# EAGLE design Painel_V1.0.2 (EAGLE 8.2.2)
CNAME: SimulaCare; CREVISION: 1.0.2; DESIGNER: Rinaldo
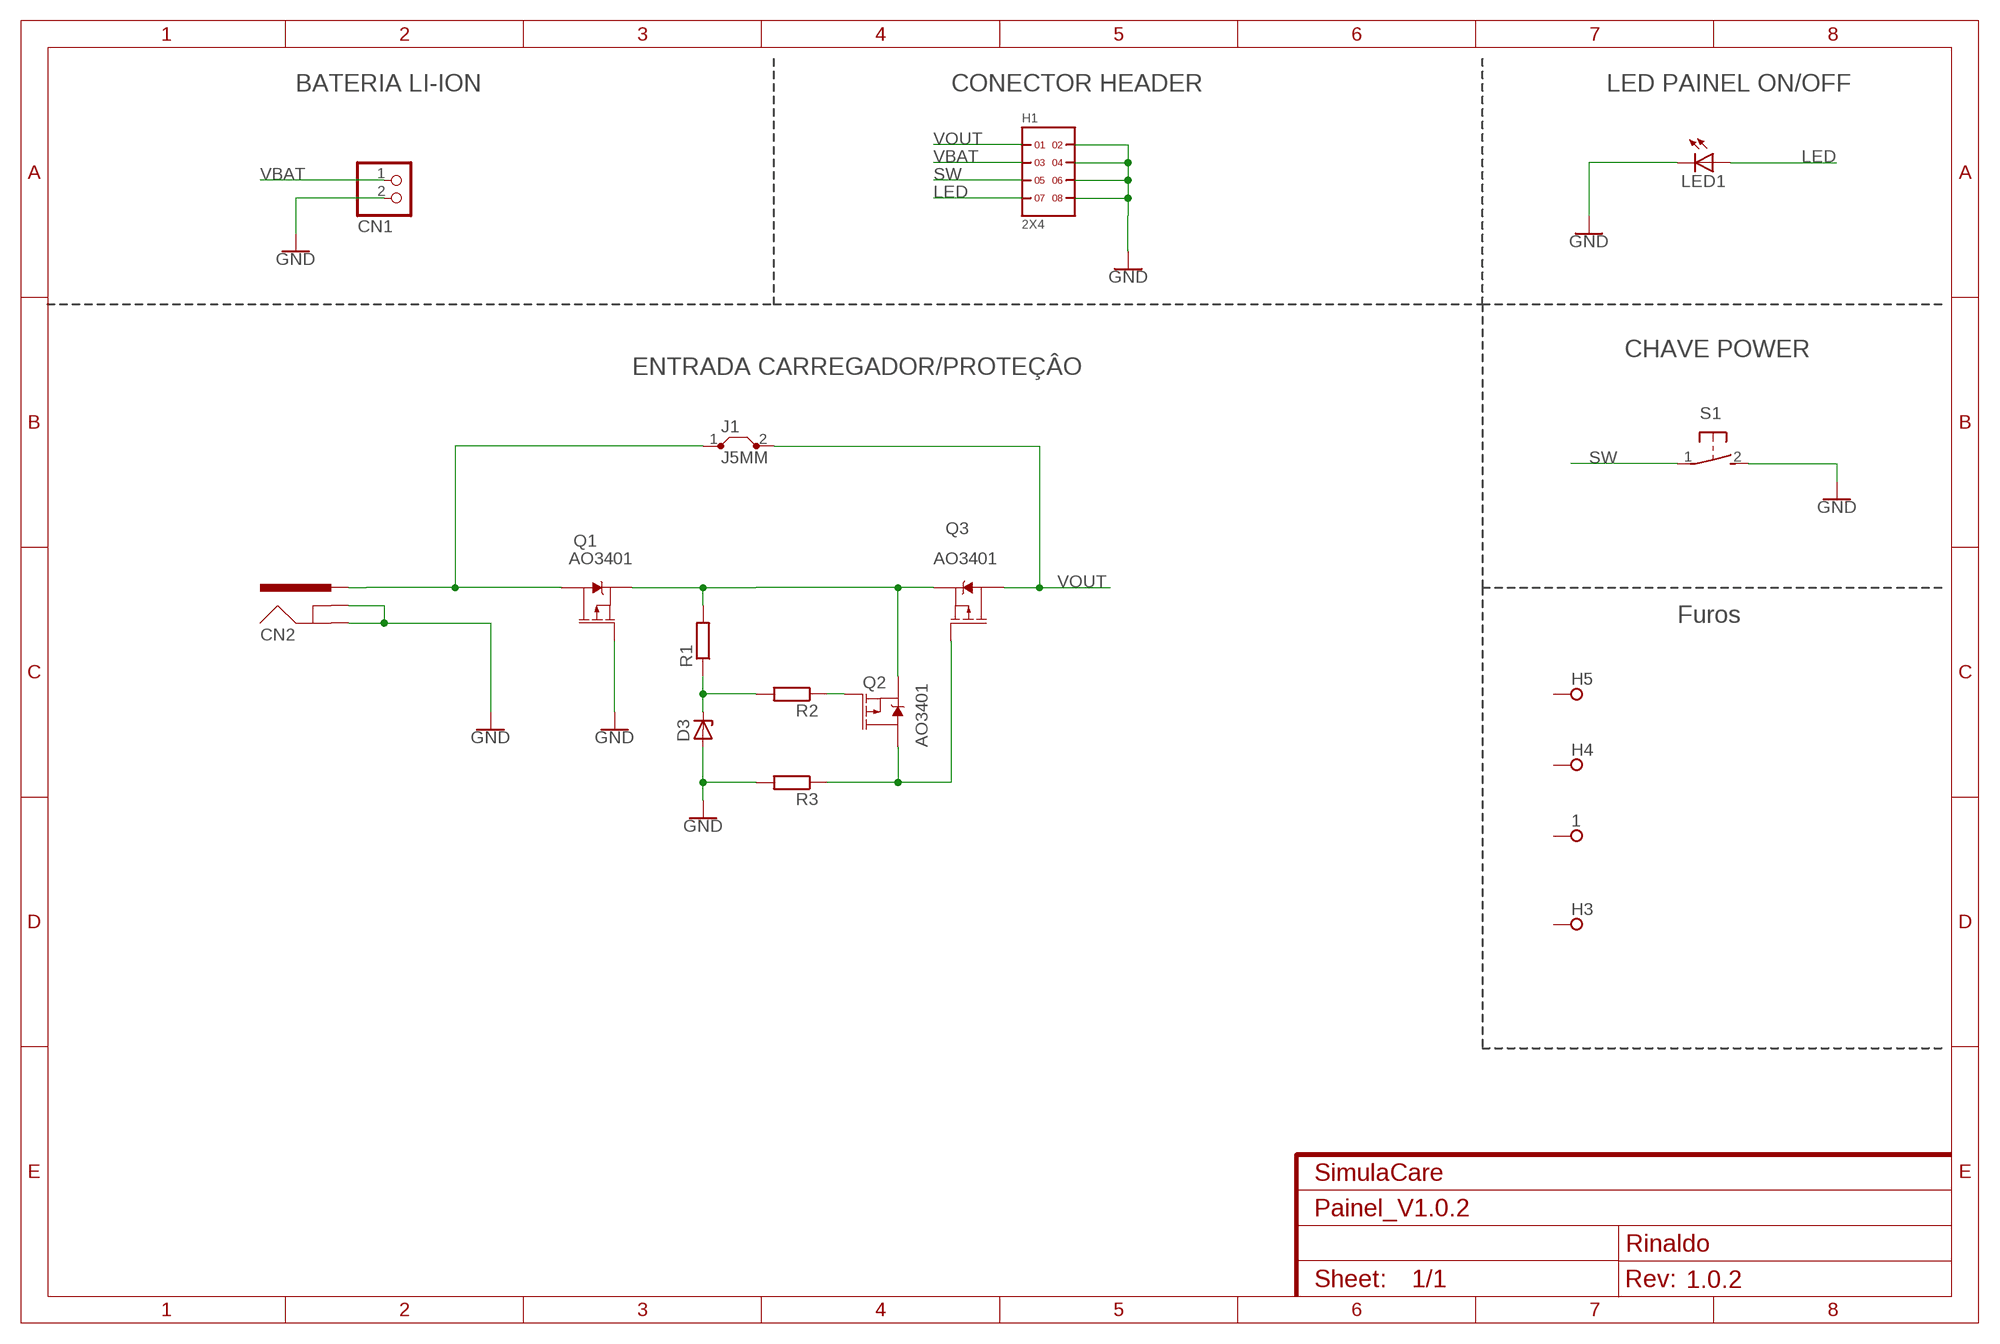
[diagram p0: schematic, sheet 1]

## Parts
1  SPECIAL_DRILL_0.1250  [PAD_0.1250]
CN1  JST_2PIN-THM  [JST-PH-2-THM]
CN2  POWERJACK  [POWERJACK]
D3  ZENER-DIODESOT23  [SOT23]
H1  2X4  [2X4]
H3  SPECIAL_DRILL_0.1250  [PAD_0.1250]
H4  SPECIAL_DRILL_0.1250  [PAD_0.1250]
H5  SPECIAL_DRILL_0.1250  [PAD_0.1250]
J1  J5MM  [05]
LED1  LED3MM  [LED3MM]
Q1  AO3401  MOSFET_PCH-IRLML2244  [SOT23-3]
Q2  AO3401  MOSFET_PCH-IRLML2244  [SOT23-3]
Q3  AO3401  MOSFET_PCH-IRLML2244  [SOT23-3]
R1  R-EU_R0603  [R0603]
R2  R-EU_R0603  [R0603]
R3  R-EU_R0603  [R0603]
S1  31-XX  [B3F-31XX]

## Nets
GND: CN1.2 CN2.GND CN2.GNDBREAK D3.1(A) H1.2 H1.4 H1.6 H1.8 LED1.K(C) Q1.1(G) R3.2 S1.2(S)
LED: H1.7 LED1.A
N$1: Q1.2(S) Q2.2(S) Q3.2(S) R1.2
N$2: D3.3(C) R1.1 R2.2
N$3: Q2.1(G) R2.1
N$4: Q2.3(D) Q3.1(G) R3.1
SW: H1.5 S1.1(P)
VBAT: CN1.1 H1.3
VCC: CN2.PWR J1.1 Q1.3(D)
VOUT: H1.1 J1.2 Q3.3(D)
Unconnected: 1.1 H3.1 H4.1 H5.1

## Notes on the sheet
- BATERIA LI-ION | CONECTOR HEADER | LED PAINEL ON/OFF
- CHAVE POWER
- ENTRADA CARREGADOR/PROTEÇÂO
- Furos

## Library data of the parts
1 H3-H5 = special-drill:SPECIAL_DRILL_: Special drills
CN1 = adafruit:JST_2PIN: JST 2-Pin Connectors of various flavors SMT-RA (S2B-PH-SM4) 4UConnector #17311 SMT (B2B-PH-SM4) THM-RA (S2B-PH) THM (B2B-PH)
CN2 = mbr0520:POWERJACK: Power Jack Standard 2.1 mm * 5.5 mm barrel jack for power (e.g. Arduino).
D3 = diode:ZENER-DIODE: Z-Diode
H1 = headers(.1in):2X4
J1 = jumper:J: Bridge
LED1 = adafruit:LED: LED OSRAM: - CHIPLED LG R971, LG N971, LY N971, LG Q971, LY Q971, LO R971, LY R971 LH N974, LH R974 LS Q976, LO Q976, LY Q976 LO Q996 - Hyper CHIPLED LW Q18S LB Q993, LB Q99A, LB R99A - SideLED LS A670, LO A670, LY A670, LG A670, LP A670 LB A673, LV A673, LT A673, LW A673 LH A674 LY A675 LS A676, LA A676, LO A676, LY A676, LW A676 LS A679, LY A679, LG A679 - Hyper Micro SIDELED® LS Y876, LA Y876, LO Y876, LY Y876 LT Y87S - SmartLED LW L88C, LW L88S LB L89C, LB L89S, LG L890 LS L89K, LO L89K, LY L89K LS L896, LA L896, LO L896, LY L896 - TOPLED LS T670, LO T670, LY T670, LG T670, LP T670 LSG T670, LSP T670, LSY T670, LOP T670, LYG T670 LG T671, LOG T671, LSG T671 LB T673, LV T673, LT T673, LW T673 LH T674 LS T676, LA T676, LO T676, LY T676, LB T676, LH T676, LSB T676, LW T676 LB T67C, LV T67C, LT T67C, LS T67K, LO T67K, LY T67K, LW E67C LS E67B, LA E67B, LO E67B, LY E67B, LB E67C, LV E67C, LT E67C LW T67C LS T679, LY T679, LG T679 LS T770, LO T770, LY T770, LG T770, LP T770 LB T773, LV T773, LT T773, LW T773 LH T774 LS E675, LA E675, LY E675, LS T675 LS T776, LA T776, LO T776, LY T776, LB T776 LHGB T686 LT T68C, LB T68C - Hyper Mini TOPLED® LB M676 - Mini TOPLED Santana® LG M470 LS M47K, LO M47K, LY M47K Source: http://www.osram.convergy.de/
Q1-Q3 = SparkFun-DiscreteSemi:MOSFET_PCH: P-channel MOSFETs Voltage controlled devices that allow control of high current outputs. SparkFun Products: SparkFun ESP32 Thing <https://www.sparkfun.com/products/13907> SparkFun ESP8266 Thing <https://www.sparkfun.com/products/13231>; PROD_ID: TRANS-11153; VALUE: 4.3A/20V/54mΩ
R1-R3 = resistor:R-EU_: RESISTOR, European symbol
S1 = adafruit:31-XX: OMRON SWITCH Now with beefier pads!

## Board
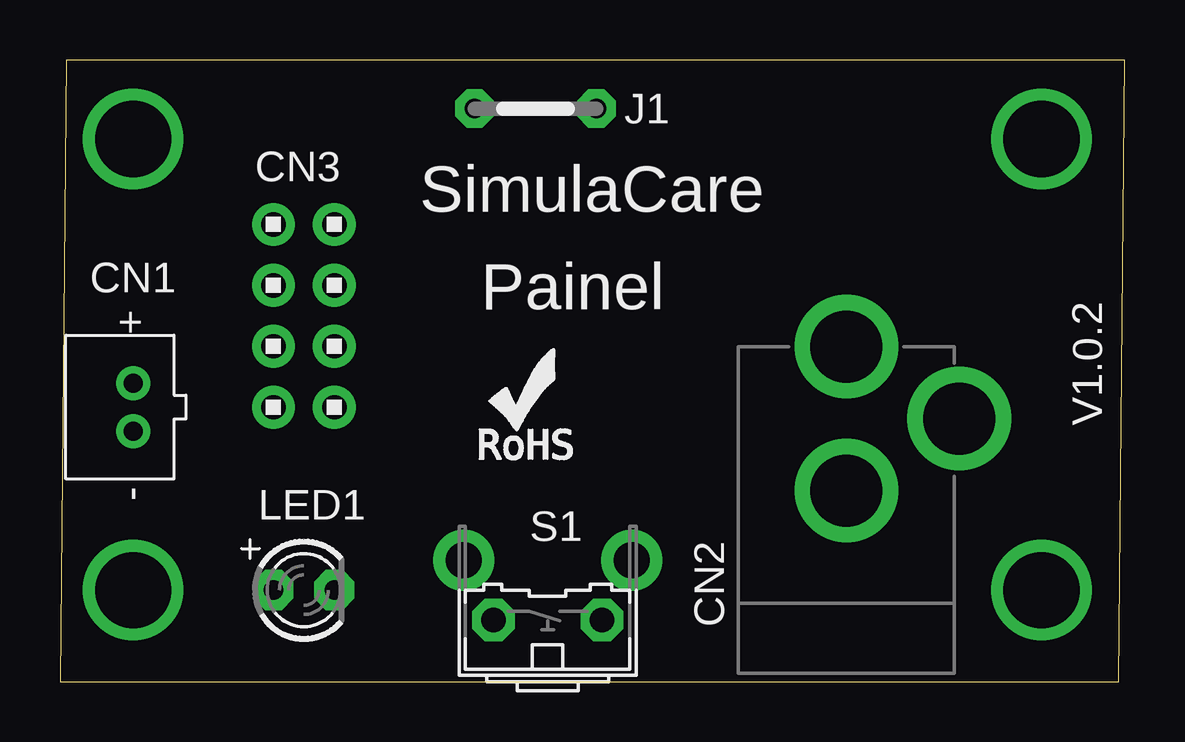
[diagram p1: board, top side]
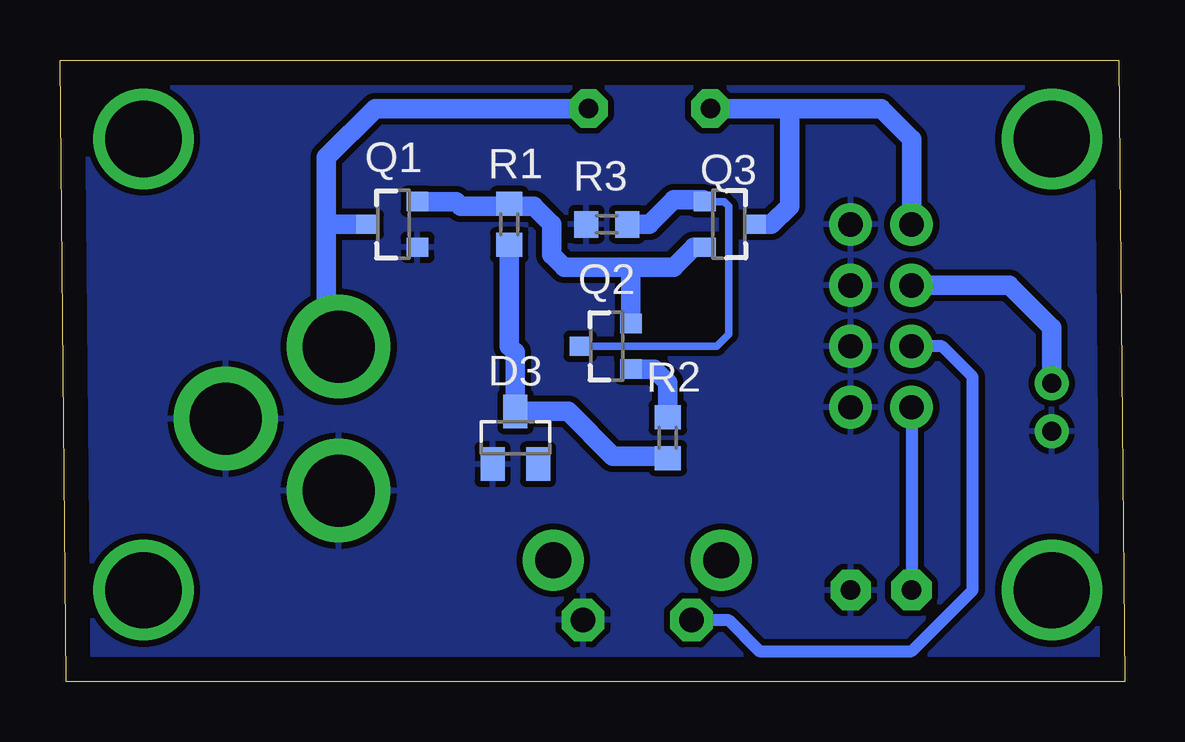
[diagram p2: board, bottom side, seen from below]

Size 44.37 x 25.9 mm. Coordinates in mm from the lower left corner, seen from the top.
Outline: 0,0 44.12,0 44.37,25.9 0.25,25.9 0,0
Copper layers (1*16): Top 0.035mm / dielectric 1.5mm / Bottom 0.035mm
Design rules "default *": minimum track width 8mil, minimum drill 0.5mm, track to track 10mil, track to pad 10mil, pad to pad 10mil, via to via 10mil, smd to smd 10mil, copper to edge 40mil, drill to drill 8mil, minimum pad ring 10mil, minimum via ring 8mil, stop-mask expansion 4mil, vias tented up to drill 0mil, thermal gap 10mil

### Footprints (pad centres in the part's own frame; a part is rotated, then mirrored left to right if it is on the bottom)
PAD_0.1250 = drill 3.175 pad 3.175: 1 0,0
JST-PH-2-THM = drill 0.8 pad 1.422: 1 1,0; 2 -1,0
POWERJACK = drill 2.997 pad 4.318: GND 0,7.7; GNDBREAK 4.7,10.7; PWR 0,13.7
SOT23 = smd 1 x 1.4: 1 -0.95,-1.1; 2 0.95,-1.1; 3 0,1.1
2X4 = drill 1.016 pad 1.778: 1 0,0; 2 0,2.54; 3 2.54,0; 4 2.54,2.54; 5 5.08,0; 6 5.08,2.54; 7 7.62,0; 8 7.62,2.54
05 = drill 0.813 pad 1.6 octagon: 1 -2.54,0; 2 2.54,0
LED3MM = drill 0.813 pad 1.676 octagon: A -1.27,0; K 1.27,0
SOT23-3 = smd 0.8 x 0.9: 1 -0.95,-1; 2 0.95,-1; 3 0,1.1
R0603 = smd 1 x 1.1: 1 -0.85,0; 2 0.85,0
B3F-31XX = drill 1.016 pad 1.778 octagon: 1 -2.261,-1.245; 2 2.261,-1.245 | drill 1.499 pad 2.54: 3 -3.505,1.245; 4 3.505,1.245

### Placement (x,y rotation side)
1  3.05,22.61 0 top
CN1  3.05,11.43 90 top
CN2  32.77,0.25 0 top
D3  25.4,10.16 0 bottom
H1  8.89,19.05 270 top
H3  40.89,22.61 0 top
H4  40.89,3.81 0 top
H5  3.05,3.81 0 top
J1  19.81,23.88 180 top
LED1  10.16,3.81 0 top
Q1  30.48,19.05 90 bottom
Q2  21.59,13.97 90 bottom
Q3  16.51,19.05 270 bottom
R1  25.65,19.05 90 bottom
R2  19.05,10.16 270 bottom
R3  21.59,19.05 180 bottom
S1  20.32,3.81 0 top
U$1  [ROHS_LOGO_0.18_IN]  17.27,9.14 0 top

### Tracks (layer width: path | path; a pad name or v marks a point on that pad's centre or on a via)
GND
  pour Bottom: 0.25,25.91 44.2,25.91 44.2,0 0.25,0
LED
  Bottom 0.508: H1.7 LED1.A
N$1
  Bottom 0.508: 25.74,19.81 R1.2 | Q3.2 17.97,18.1 | 20.59,17.27 20.58,17.27
  Bottom 0.813: Q1.2 27.87,20 27.69,19.81 25.74,19.81 24.64,19.81 23.88,19.05 23.88,17.78 23.37,17.27 20.58,17.27 18.8,17.27 17.97,18.1 | Q2.2 20.59,17.27
N$2
  Bottom 0.508: R2.2 19.14,9.4
  Bottom 0.813: 19.14,9.4 R2.2 19.14,9.4 | R1.1 25.65,13.97 25.4,13.72 D3.3 23.2,11.26 21.34,9.4 19.14,9.4
N$3
  Bottom 0.813: Q2.1 19.62,13.02 19.05,12.45 R2.1
N$4
  Bottom 0.305: Q3.1 16.7,20 16.51,19.81 16.51,14.48 17.02,13.97 Q2.3
  Bottom 0.508: 17.58,20.07 Q3.1
  Bottom 0.813: R3.1 19.81,19.05 18.8,20.07 17.58,20.07
SW
  Bottom 0.508: S1.1 16.54,2.56 15.24,1.27 8.89,1.27 6.35,3.81 6.35,12.7 7.62,13.97 H1.5
VBAT
  Bottom 0.813: H1.3 4.83,16.51 3.05,14.73 CN1.1
VCC
  Bottom 0.813: J1.1 31.24,23.88 33.27,21.84 33.27,18.79 | 33.27,18.79 33.27,14.46 CN2.PWR | Q1.3 33.01,19.05 33.27,18.79
VOUT
  Bottom 0.813: 14.08,23.88 J1.2 | 14.08,23.88 10.16,23.88 8.89,22.61 H1.1 | Q3.3 14.73,19.05 13.97,19.81 13.97,23.77 14.08,23.88

### Text on the board
tPlace: CN3 | SimulaCare | Painel | V1.0.2